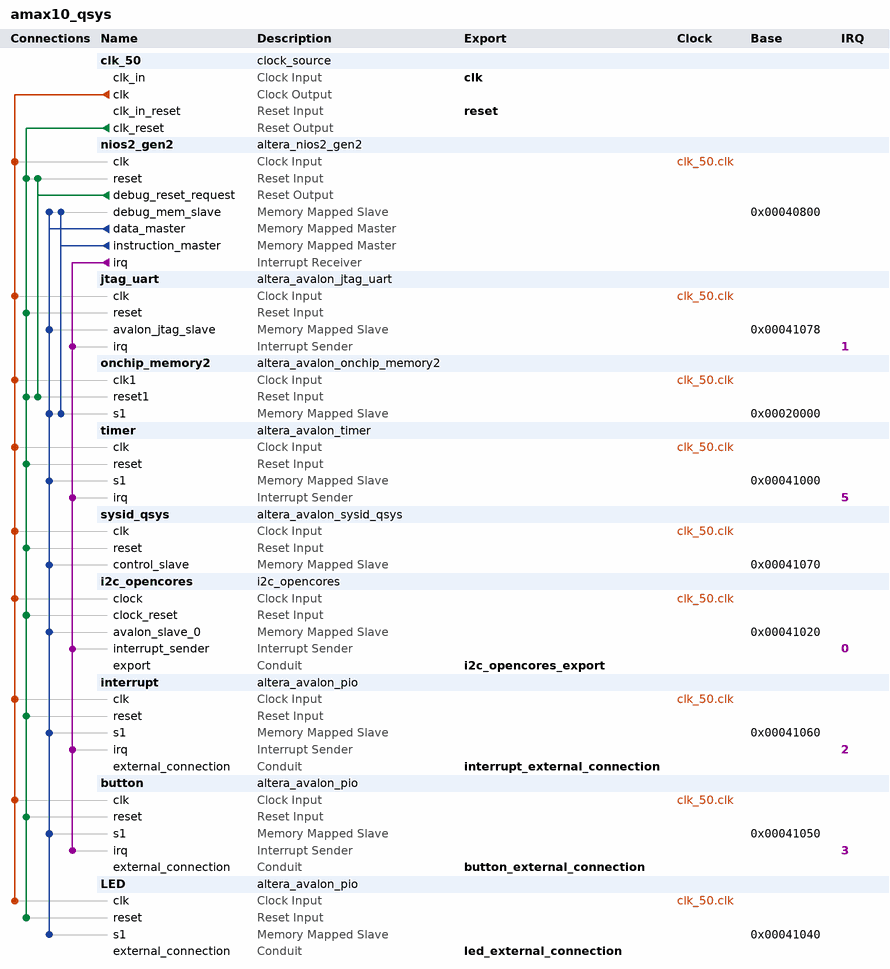
[diagram p0: system contents]
# Platform Designer (Qsys) system amax10_qsys, MAX 10 10M50DAF484C6GES
# Parameters at their usual value, and those the tool derives, are not listed.
package require -exact qsys 15.0
create_system amax10_qsys
set_project_property DEVICE_FAMILY {MAX 10}
set_project_property DEVICE 10M50DAF484C6GES

add_instance clk_50 clock_source 15.0
set_instance_parameter_value clk_50 clockFrequency 50000000

add_instance nios2_gen2 altera_nios2_gen2 15.0
set_instance_parameter_value nios2_gen2 dcache_size 2048
set_instance_parameter_value nios2_gen2 exceptionSlave onchip_memory2.s1
set_instance_parameter_value nios2_gen2 icache_size 4096
set_instance_parameter_value nios2_gen2 impl Fast
set_instance_parameter_value nios2_gen2 resetSlave onchip_memory2.s1

add_instance jtag_uart altera_avalon_jtag_uart 15.0
set_instance_parameter_value jtag_uart simInteractiveOptions NO_INTERACTIVE_WINDOWS

add_instance onchip_memory2 altera_avalon_onchip_memory2 15.0
set_instance_parameter_value onchip_memory2 dataWidth 32
set_instance_parameter_value onchip_memory2 dualPort false
set_instance_parameter_value onchip_memory2 initMemContent false
set_instance_parameter_value onchip_memory2 initializationFileName onchip_mem.hex
set_instance_parameter_value onchip_memory2 memorySize 130000

add_instance timer altera_avalon_timer 15.0
set_instance_parameter_value timer period 1
set_instance_parameter_value timer periodUnits MSEC

add_instance sysid_qsys altera_avalon_sysid_qsys 15.0
set_instance_parameter_value sysid_qsys id 0

add_instance i2c_opencores i2c_opencores 12.0

add_instance interrupt altera_avalon_pio 15.0
set_instance_parameter_value interrupt captureEdge true
set_instance_parameter_value interrupt direction Input
set_instance_parameter_value interrupt edgeType FALLING
set_instance_parameter_value interrupt generateIRQ true
set_instance_parameter_value interrupt irqType EDGE
set_instance_parameter_value interrupt width 1

add_instance button altera_avalon_pio 15.0
set_instance_parameter_value button captureEdge true
set_instance_parameter_value button direction Input
set_instance_parameter_value button edgeType FALLING
set_instance_parameter_value button generateIRQ true
set_instance_parameter_value button irqType EDGE
set_instance_parameter_value button width 1

add_instance LED altera_avalon_pio 15.0
set_instance_parameter_value LED direction Output
set_instance_parameter_value LED width 8

# connections
add_connection clk_50.clk button.clk clock
add_connection clk_50.clk i2c_opencores.clock clock
add_connection clk_50.clk interrupt.clk clock
add_connection clk_50.clk jtag_uart.clk clock
add_connection clk_50.clk LED.clk clock
add_connection clk_50.clk nios2_gen2.clk clock
add_connection clk_50.clk onchip_memory2.clk1 clock
add_connection clk_50.clk sysid_qsys.clk clock
add_connection clk_50.clk timer.clk clock
add_connection clk_50.clk_reset button.reset reset
add_connection clk_50.clk_reset i2c_opencores.clock_reset reset
add_connection clk_50.clk_reset interrupt.reset reset
add_connection clk_50.clk_reset jtag_uart.reset reset
add_connection clk_50.clk_reset LED.reset reset
add_connection clk_50.clk_reset nios2_gen2.reset reset
add_connection clk_50.clk_reset onchip_memory2.reset1 reset
add_connection clk_50.clk_reset sysid_qsys.reset reset
add_connection clk_50.clk_reset timer.reset reset
add_connection nios2_gen2.debug_reset_request nios2_gen2.reset reset
add_connection nios2_gen2.debug_reset_request onchip_memory2.reset1 reset
add_connection nios2_gen2.data_master button.s1 avalon
set_connection_parameter_value nios2_gen2.data_master/button.s1 baseAddress 0x00041050
add_connection nios2_gen2.data_master i2c_opencores.avalon_slave_0 avalon
set_connection_parameter_value nios2_gen2.data_master/i2c_opencores.avalon_slave_0 baseAddress 0x00041020
add_connection nios2_gen2.data_master interrupt.s1 avalon
set_connection_parameter_value nios2_gen2.data_master/interrupt.s1 baseAddress 0x00041060
add_connection nios2_gen2.data_master jtag_uart.avalon_jtag_slave avalon
set_connection_parameter_value nios2_gen2.data_master/jtag_uart.avalon_jtag_slave baseAddress 0x00041078
add_connection nios2_gen2.data_master LED.s1 avalon
set_connection_parameter_value nios2_gen2.data_master/LED.s1 baseAddress 0x00041040
add_connection nios2_gen2.data_master nios2_gen2.debug_mem_slave avalon
set_connection_parameter_value nios2_gen2.data_master/nios2_gen2.debug_mem_slave baseAddress 0x00040800
add_connection nios2_gen2.data_master onchip_memory2.s1 avalon
set_connection_parameter_value nios2_gen2.data_master/onchip_memory2.s1 baseAddress 0x00020000
add_connection nios2_gen2.data_master sysid_qsys.control_slave avalon
set_connection_parameter_value nios2_gen2.data_master/sysid_qsys.control_slave baseAddress 0x00041070
add_connection nios2_gen2.data_master timer.s1 avalon
set_connection_parameter_value nios2_gen2.data_master/timer.s1 baseAddress 0x00041000
add_connection nios2_gen2.instruction_master nios2_gen2.debug_mem_slave avalon
set_connection_parameter_value nios2_gen2.instruction_master/nios2_gen2.debug_mem_slave baseAddress 0x00040800
add_connection nios2_gen2.instruction_master onchip_memory2.s1 avalon
set_connection_parameter_value nios2_gen2.instruction_master/onchip_memory2.s1 baseAddress 0x00020000
add_connection nios2_gen2.irq button.irq interrupt
set_connection_parameter_value nios2_gen2.irq/button.irq irqNumber 3
add_connection nios2_gen2.irq i2c_opencores.interrupt_sender interrupt
set_connection_parameter_value nios2_gen2.irq/i2c_opencores.interrupt_sender irqNumber 0
add_connection nios2_gen2.irq interrupt.irq interrupt
set_connection_parameter_value nios2_gen2.irq/interrupt.irq irqNumber 2
add_connection nios2_gen2.irq jtag_uart.irq interrupt
set_connection_parameter_value nios2_gen2.irq/jtag_uart.irq irqNumber 1
add_connection nios2_gen2.irq timer.irq interrupt
set_connection_parameter_value nios2_gen2.irq/timer.irq irqNumber 5

# exported interfaces
add_interface button_external_connection conduit end
set_interface_property button_external_connection EXPORT_OF button.external_connection
add_interface clk clock sink
set_interface_property clk EXPORT_OF clk_50.clk_in
add_interface i2c_opencores_export conduit end
set_interface_property i2c_opencores_export EXPORT_OF i2c_opencores.export
add_interface interrupt_external_connection conduit end
set_interface_property interrupt_external_connection EXPORT_OF interrupt.external_connection
add_interface led_external_connection conduit end
set_interface_property led_external_connection EXPORT_OF LED.external_connection
add_interface reset reset sink
set_interface_property reset EXPORT_OF clk_50.clk_in_reset

set_interconnect_requirement {$system} qsys_mm.clockCrossingAdapter HANDSHAKE
set_interconnect_requirement {$system} qsys_mm.insertDefaultSlave FALSE
set_interconnect_requirement {$system} qsys_mm.maxAdditionalLatency 1

save_system amax10_qsys.qsys
